# EAGLE design badito_V5 (EAGLE 9.6.2)
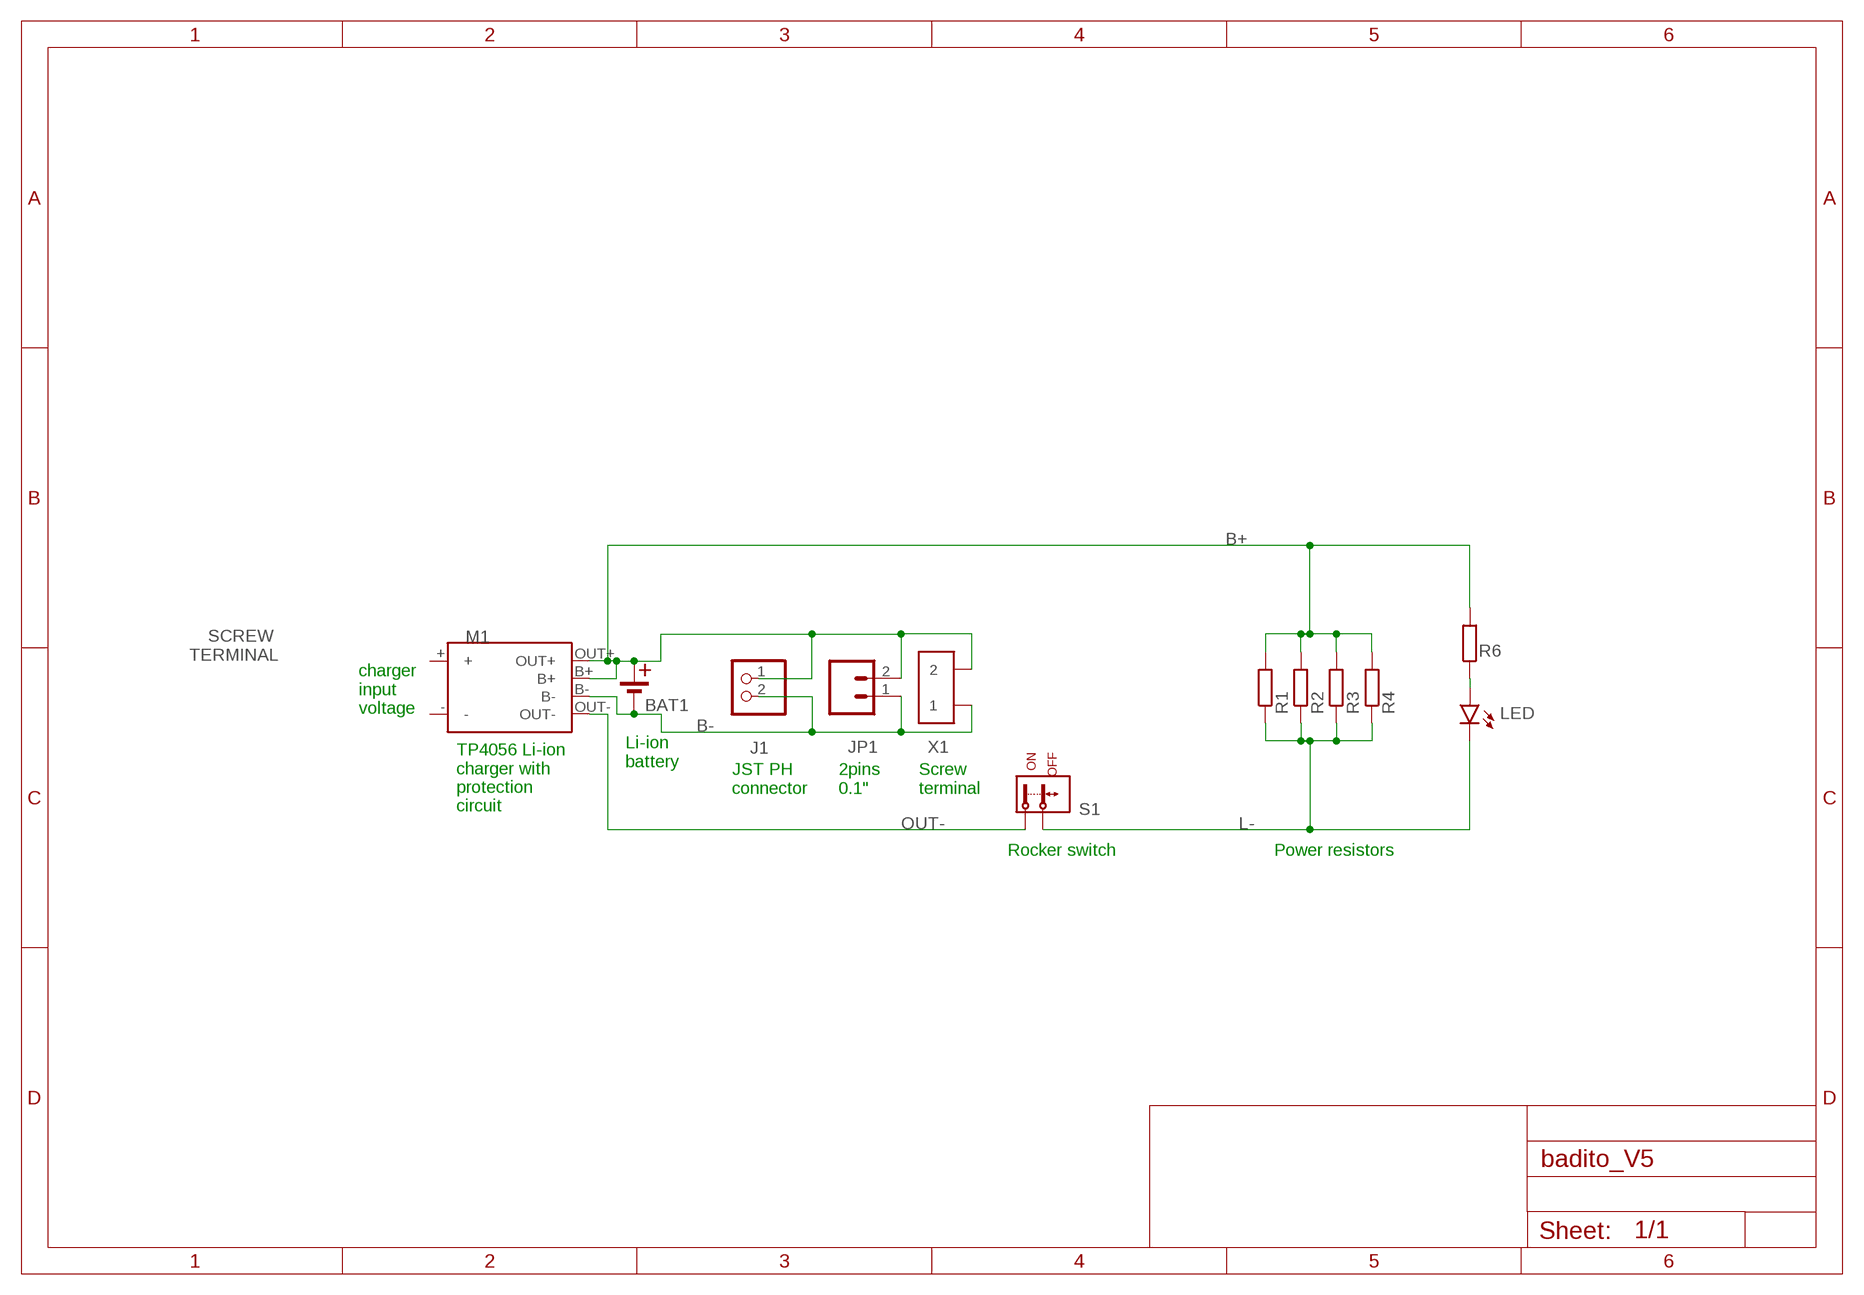
[diagram p0: schematic, sheet 1]

## Parts
BAT1  KS18650X1-SMT  [KS18650X1-SMT]
J1  JST_2PIN-SMT  [JST-PH-2-SMT]
JP1  1X02_2.54MM_ROUND  [1X02_2.54MM_ROUND]
LED  RED  LED0603-RED  [LED-0603]
M1  TP4056_CHG_PROT  [BAT_CHG_PROT_BRD_27.9X17.4MM]
R1  R  [R_PWR_CEMENT_10W]
R2  R  [R_PWR_CEMENT_10W]
R3  R  [R_PWR_CEMENT_10W]
R4  R  [R_PWR_CEMENT_10W]
R6  250R  R0603_300R  [R0603]
S1  SWITCH_ROCKER_KCDI-101  [SWITCH_ROCKER_KCDI-101]
X1  ED350/2  [ED350/2]

## Nets
B+: BAT1.+ J1.1 JP1.2 M1.B+ M1.OUT+ R1.1 R2.1 R3.1 R4.1 R6.2 X1.P$2
B-: BAT1.- J1.2 JP1.1 M1.B- X1.P$1
L-: LED.C R1.2 R2.2 R3.2 R4.2 S1.2(2.1) S1.2_2(2.1)
N$2: LED.A R6.1
OUT-: M1.OUT- S1.1(1.1) S1.1_1(1.1)
Unconnected: M1.+ M1.-

## Notes on the sheet
- SCREW 
  TERMINAL
- charger 
  input 
  voltage
- Li-ion 
  battery
- JST PH
  connector
- 2pins 
  0.1"
- Screw 
  terminal
- TP4056 Li-ion
  charger with
  protection
  circuit
- Rocker switch | Power resistors

## Library data of the parts
BAT1 = TSEM:KS18650X1-SMT: 18650 battery holder SMT BeiLaMoo KS18650X1-SMT
J1 = sodaq:JST_2PIN: Connector JST 2p 2.0mm SMT vertical; FARNELL_OC: 1841394
JP1 = sodaq:1X02; FARNELL_OC: 1593411; MPN: 2211S-02G
LED = sodaq:LED: LED Standard schematic elements and footprints for 5mm, 3mm, 1206, and 0603 sized LEDs.; FARNELL_OC: 2099224; MF: Kingbright; MPN: KPT-1608SURCK
M1 = TSEM:TP4056_CHG_PROT: 18650 battery protection PCBA module
R1-R4 = TSEM:R: Resistor
R6 = TSEM:R: Resistor; FARNELL_OC: 9330968
S1 = TSEM:SWITCH_ROCKER_KCDI-101
X1 = electronicload:ED350/2: ED350/X (5.0 mm) TERMINAL BLOCK 5MM VERT 2POS PCB Datasheet http://www.on-shore.com/sites/default/files/manuals/edz350.pdf; DIGIKEY: ED1930-ND

## Board
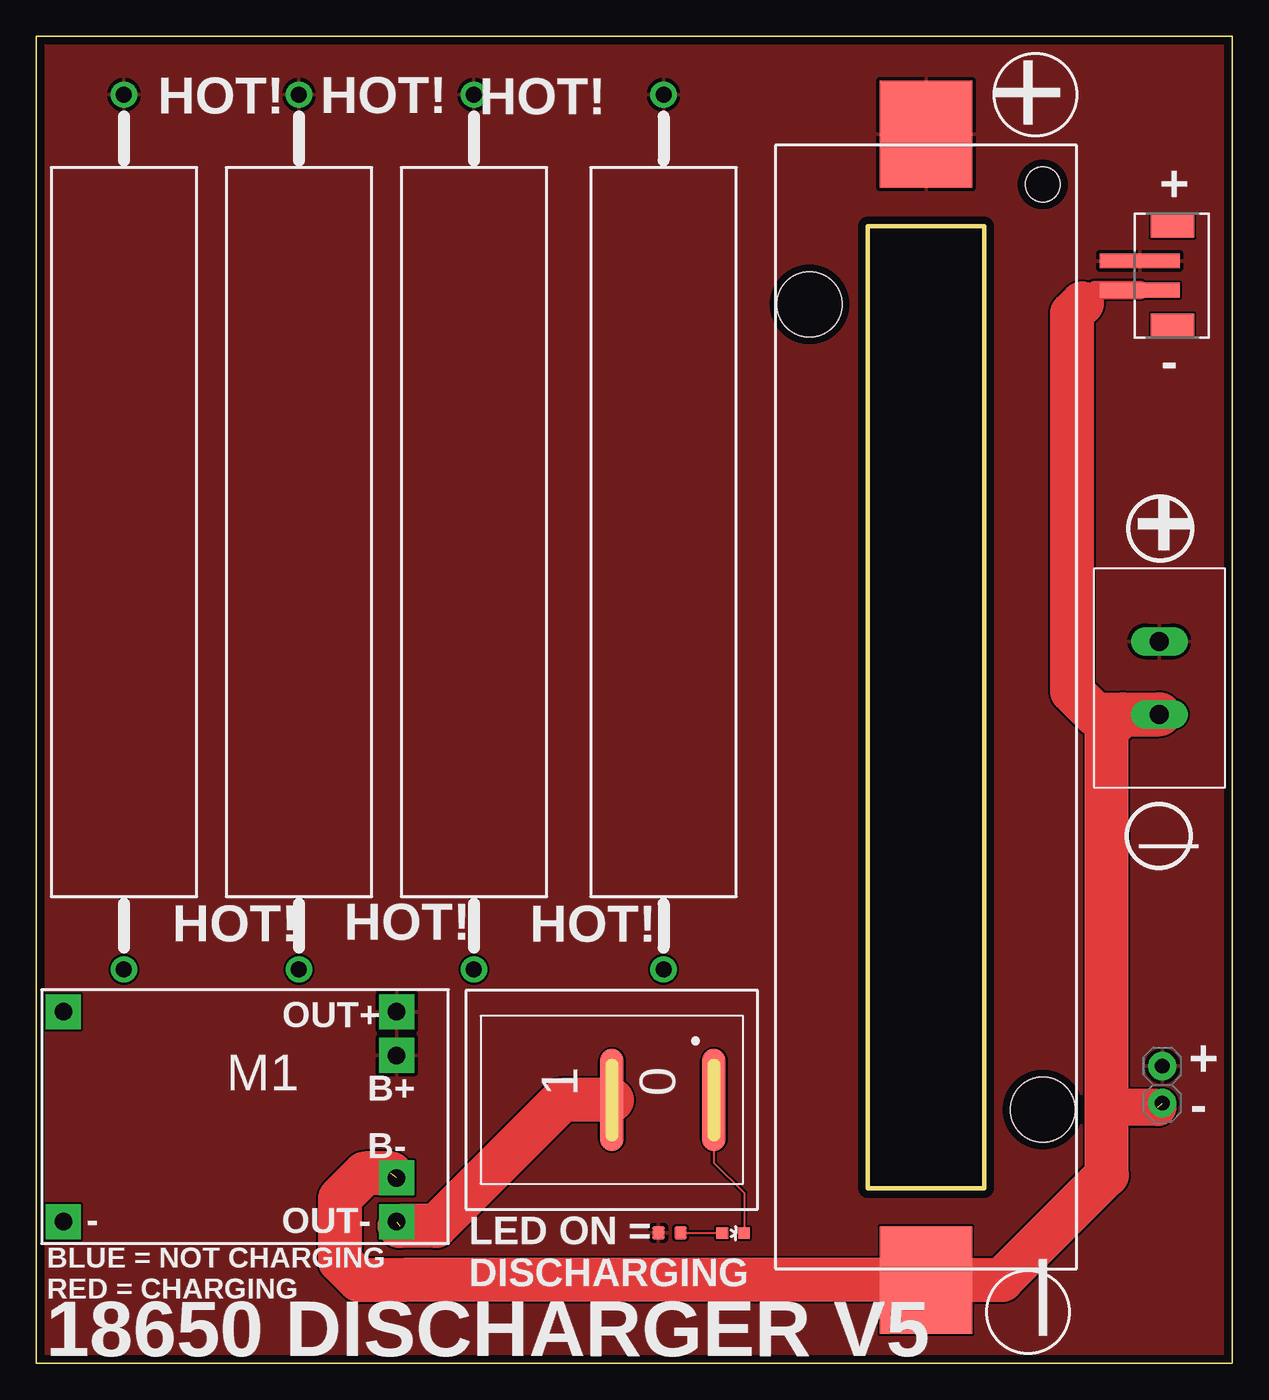
[diagram p1: board, top side]
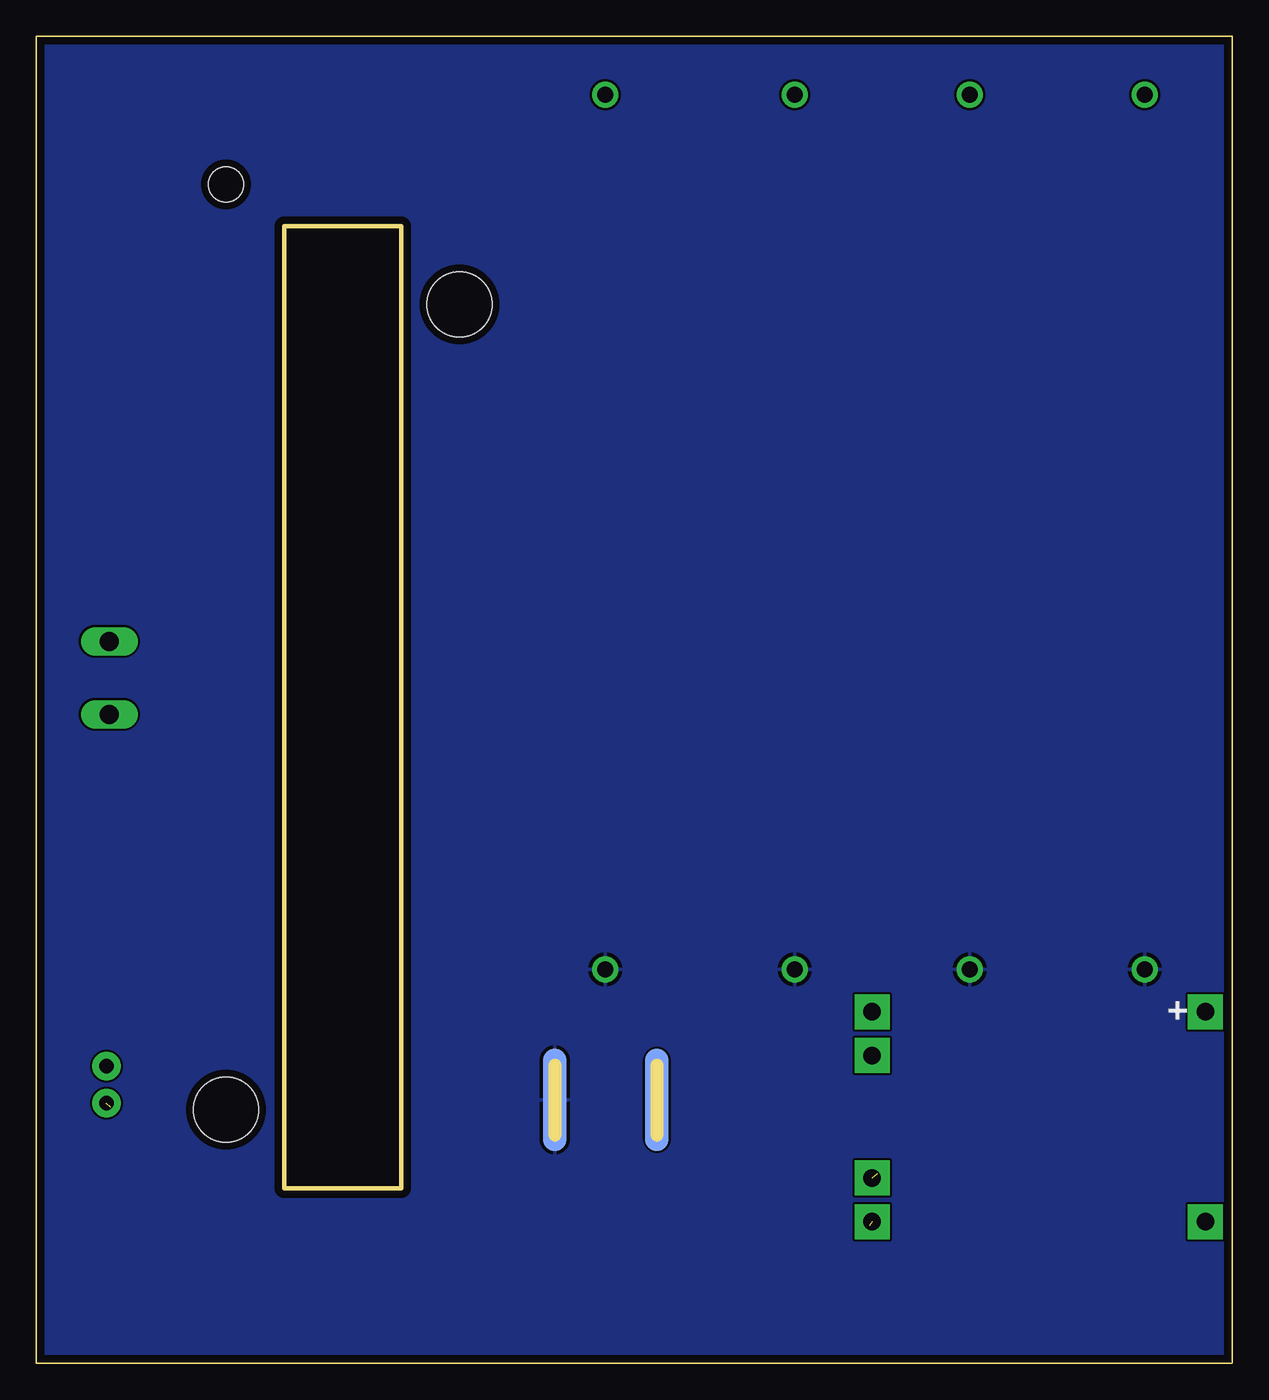
[diagram p2: board, bottom side, seen from below]

Size 82 x 91 mm. Coordinates in mm from the lower left corner, seen from the top.
Outline: 57,78 57,12 65,12 65,78 57,78
Outline: 0,0 82,0 82,91 0,91 0,0
Copper layers (1*16): Top 0.035mm / dielectric 1.6mm / Bottom 0.035mm
Design rules "Elecrow_2-layer_PCB_eagle_rule": minimum track width 6mil, minimum drill 12mil, track to track 6mil, track to pad 6mil, pad to pad 6mil, via to via 8mil, smd to smd 0mil, copper to edge 20mil, drill to drill 10mil, minimum pad ring 6mil, minimum via ring 6mil, stop-mask expansion 0mil, vias tented up to drill 100mil, thermal gap 10mil

### Footprints (pad centres in the part's own frame; a part is rotated, then mirrored left to right if it is on the bottom)
KS18650X1-SMT = smd 7.34 x 6.35: + 39.305,0; - -39.305,0 | hole 4.45: 27.62,8; -27.62,-8 | hole 2.39: 35.84,-8
JST-PH-2-SMT = smd 1 x 5.5: 1 -1,-2.25; 2 1,-2.25 | smd 1.6 x 3: NC1 -3.4,0; NC2 3.4,0
1X02_2.54MM_ROUND = drill 1.016 pad 1.93: 1 -1.27,0; 2 1.27,0
LED-0603 = smd 0.8 x 0.8: A 0,-0.75; C 0,0.75
BAT_CHG_PROT_BRD_27.9X17.4MM = drill 1.2 pad 2.4 square: + -12.45,7.2; - -12.45,-7.2; B+ 10.4,4.2; B- 10.4,-4.2; OUT+ 10.4,7.2; OUT- 10.4,-7.2
R_PWR_CEMENT_10W = drill 1.1 pad 1.8: 1 0,30; 2 0,-30
R0603 = smd 0.889 x 0.889: 1 -0.762,0; 2 0.762,0
SWITCH_ROCKER_KCDI-101 = smd 7 x 1.6: 1 0,0; 2 0,-7 | smd 7 x 1.6 bottom: 1_1 0,0; 2_2 0,-7
ED350/2 = drill 1.3 long: P$1 0,-2.5; P$2 0,2.5

### Placement (x,y rotation side)
BAT1  61,45 90 top
J1  77.9,74.6 270 top
JP1  77.2,19.1 90 top
LED  47.77,8.91 270 top
M1  14.3,16.9 0 top
R1  18,57 0 top
R2  6,57 0 top
R3  43,57 0 top
R4  30,57 0 top
R6  43.41,8.94 180 top
S1  39.45,18.05 90 top
X1  77,47 0 top

### Tracks (layer width: path | path; a pad name or v marks a point on that pad's centre or on a via)
B+
  pour Top: -1.1,-1.1 84.69,-1.1 85.91,94 -1.1,94
B-  (2 unrouted)
  Top 1.27: J1.2 72.6,73.6 71.7,72.7
  Top 2.54: 76.9,17.53 73.87,17.53 73.4,18
  Top 3: 71.7,72.7 71,72 71,46.1 72.6,44.5 74.5,44.5 | 74.5,44.5 X1.P$1 | 25.2,5.7 BAT1.- 66.19,5.7 73.4,12.9 73.4,18 73.4,43.4 74.5,44.5 | 25.2,5.7 | 25.2,5.7 22.11,5.7 20.8,7 20.8,11.3 22.5,13 24.3,13
L-  (1 unrouted)
  Top 0.152: S1.2 46.45,13.75 48.52,11.68 LED.C
  pour Bottom: 0,0 88,0 88,95.9 0,95.9
N$2
  Top 0.152: LED.A 44.2,8.91 R6.1
OUT-  (2 unrouted)
  Top 3: 24.9,9.4 27.4,9.4 36.05,18.05 S1.1_1

### Text on the board
tPlace: HOT! | HOT! | HOT! | + | - | + | _ | HOT! | HOT! | HOT! | + | - | LED ON = / DISCHARGING | BLUE = NOT CHARGING / RED = CHARGING | 18650 DISCHARGER V5